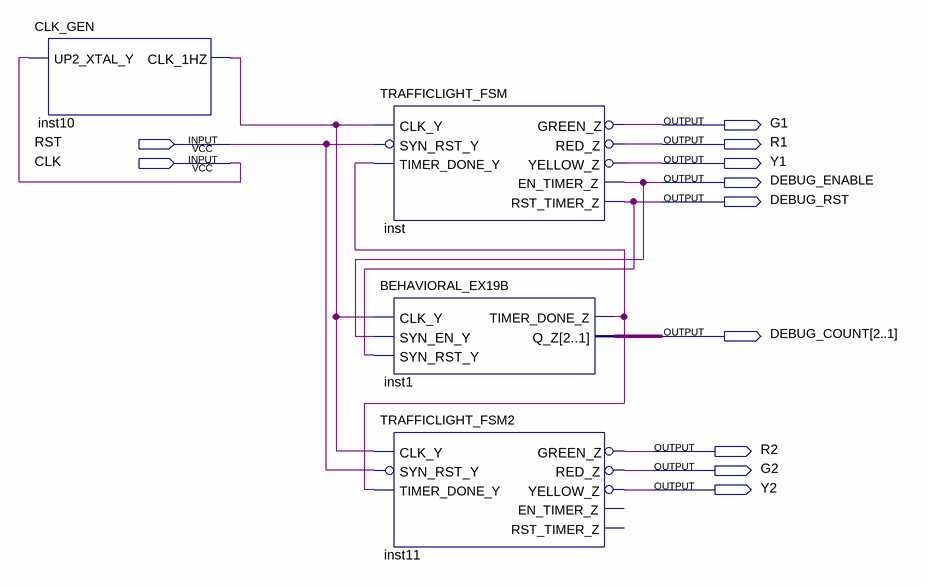
[diagram p0: schematic sheet]
// Quartus schematic Project6.bdf as structural Verilog: 4 symbols, 11 pins
module Project6 (
  input  RST,
  input  CLK,
  output G1,
  output R1,
  output Y1,
  output DEBUG_ENABLE,
  output DEBUG_RST,
  output [2:1] DEBUG_COUNT,
  output R2,
  output G2,
  output Y2
);

  wire inst1_timer_done_z, inst10_clk_1hz, inst11_green_z, inst11_red_z, inst11_yellow_z, inst_green_z,
       inst_red_z, inst_yellow_z;

  CLK_GEN inst10 (.UP2_XTAL_Y(CLK), .CLK_1HZ(inst10_clk_1hz));
  TRAFFICLIGHT_FSM inst (
    .CLK_Y(inst10_clk_1hz), .SYN_RST_Y(~RST), .TIMER_DONE_Y(inst1_timer_done_z), .GREEN_Z(inst_green_z),
    .RED_Z(inst_red_z), .YELLOW_Z(inst_yellow_z), .EN_TIMER_Z(DEBUG_ENABLE), .RST_TIMER_Z(DEBUG_RST));
  not inst_GREEN_Z_inverted (G1, inst_green_z);
  not inst_RED_Z_inverted (R1, inst_red_z);
  not inst_YELLOW_Z_inverted (Y1, inst_yellow_z);
  BEHAVIORAL_EX19B inst1 (
    .CLK_Y(inst10_clk_1hz), .SYN_EN_Y(DEBUG_ENABLE), .SYN_RST_Y(DEBUG_RST),
    .TIMER_DONE_Z(inst1_timer_done_z), .Q_Z(DEBUG_COUNT));
  TRAFFICLIGHT_FSM2 inst11 (
    .CLK_Y(inst10_clk_1hz), .SYN_RST_Y(~RST), .TIMER_DONE_Y(inst1_timer_done_z), .GREEN_Z(inst11_green_z),
    .RED_Z(inst11_red_z), .YELLOW_Z(inst11_yellow_z));  // open: EN_TIMER_Z, RST_TIMER_Z
  not inst11_GREEN_Z_inverted (R2, inst11_green_z);
  not inst11_RED_Z_inverted (G2, inst11_red_z);
  not inst11_YELLOW_Z_inverted (Y2, inst11_yellow_z);
endmodule
